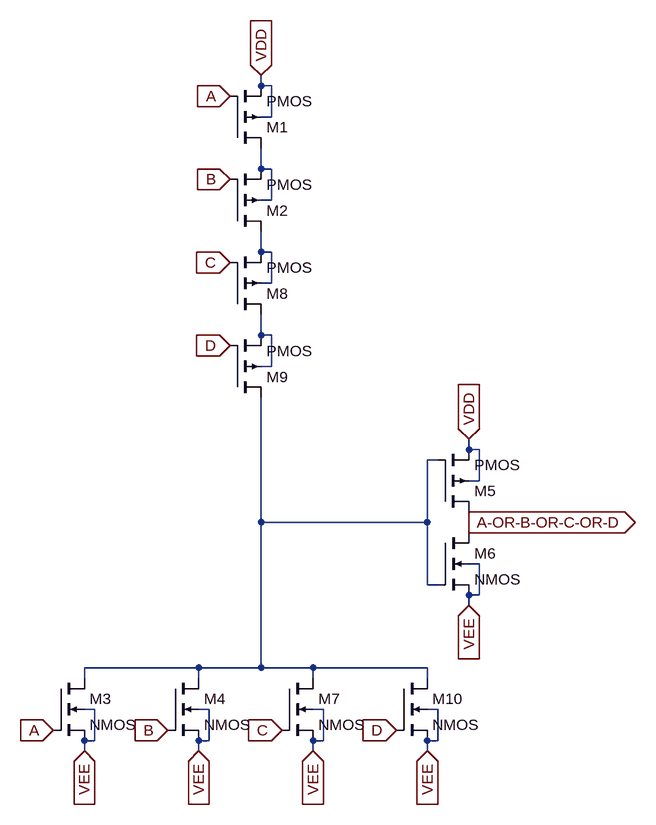
[diagram p0: schematic 4_Input_OR_Gate_Symbol.asc]
4_Input_OR_Gate_Symbol.asc, the LTspice schematic file:
Version 4
SHEET 1 888 1016
WIRE 112 -96 112 -112
WIRE 128 -96 112 -96
WIRE 128 -48 128 -96
WIRE 128 -48 112 -48
WIRE 112 32 112 0
WIRE 128 32 112 32
WIRE 128 80 128 32
WIRE 128 80 112 80
WIRE 112 160 112 128
WIRE 128 160 112 160
WIRE 128 208 128 160
WIRE 128 208 112 208
WIRE 112 288 112 256
WIRE 128 288 112 288
WIRE 128 336 128 288
WIRE 128 336 112 336
WIRE 432 464 432 448
WIRE 448 464 432 464
WIRE 384 480 368 480
WIRE 448 512 448 464
WIRE 448 512 432 512
WIRE 112 576 112 384
WIRE 368 576 368 480
WIRE 368 576 112 576
WIRE 432 576 432 560
WIRE 432 592 432 576
WIRE 448 640 432 640
WIRE 368 672 368 576
WIRE 384 672 368 672
WIRE 448 688 448 640
WIRE 448 688 432 688
WIRE 432 704 432 688
WIRE 16 800 -160 800
WIRE 112 800 112 576
WIRE 112 800 16 800
WIRE 192 800 112 800
WIRE 368 800 192 800
WIRE -160 816 -160 800
WIRE 16 816 16 800
WIRE 192 816 192 800
WIRE 368 816 368 800
WIRE -144 864 -160 864
WIRE 32 864 16 864
WIRE 208 864 192 864
WIRE 384 864 368 864
WIRE -144 912 -144 864
WIRE -144 912 -160 912
WIRE 32 912 32 864
WIRE 32 912 16 912
WIRE 208 912 208 864
WIRE 208 912 192 912
WIRE 384 912 384 864
WIRE 384 912 368 912
WIRE -160 928 -160 912
WIRE 16 928 16 912
WIRE 192 928 192 912
WIRE 368 928 368 912
FLAG 432 576 A-OR-B-OR-C-OR-D
IOPIN 432 576 Out
FLAG 64 -80 A
IOPIN 64 -80 In
FLAG -208 896 A
IOPIN -208 896 In
FLAG 64 48 B
IOPIN 64 48 In
FLAG -32 896 B
IOPIN -32 896 In
FLAG 112 -112 VDD
IOPIN 112 -112 In
FLAG 432 448 VDD
IOPIN 432 448 In
FLAG 192 928 VEE
IOPIN 192 928 In
FLAG 432 704 VEE
IOPIN 432 704 In
FLAG 144 896 C
IOPIN 144 896 In
FLAG 64 176 C
IOPIN 64 176 In
FLAG 64 304 D
IOPIN 64 304 In
FLAG 368 928 VEE
IOPIN 368 928 In
FLAG 320 896 D
IOPIN 320 896 In
FLAG 16 928 VEE
IOPIN 16 928 In
FLAG -160 928 VEE
IOPIN -160 928 In
SYMBOL pmos4 64 0 M180
SYMATTR InstName M1
SYMBOL pmos4 64 128 M180
SYMATTR InstName M2
SYMBOL nmos4 -208 816 R0
SYMATTR InstName M3
SYMBOL nmos4 -32 816 R0
SYMATTR InstName M4
SYMBOL pmos4 384 560 M180
SYMATTR InstName M5
SYMBOL nmos4 384 592 R0
SYMATTR InstName M6
SYMBOL nmos4 144 816 R0
SYMATTR InstName M7
SYMBOL pmos4 64 256 M180
SYMATTR InstName M8
SYMBOL pmos4 64 384 M180
SYMATTR InstName M9
SYMBOL nmos4 320 816 R0
SYMATTR InstName M10

The netlist it stands for:
* 4_Input_OR_Gate_Symbol.asc
M1 N001 A VDD VDD PMOS
M2 N002 B N001 N001 PMOS
M3 N004 A VEE VEE NMOS
M4 N004 B VEE VEE NMOS
M5 A-OR-B-OR-C-OR-D N004 VDD VDD PMOS
M6 A-OR-B-OR-C-OR-D N004 VEE VEE NMOS
M7 N004 C VEE VEE NMOS
M8 N003 C N002 N002 PMOS
M9 N004 D N003 N003 PMOS
M10 N004 D VEE VEE NMOS
.model NMOS NMOS
.model PMOS PMOS
.lib standard.mos
.backanno
.end